# Altium schematic sheet boxer_main.SchDoc: Schemat blokowy
size A4; DrawnBy: Damian Dolewski; Engineer: Damian Dolewski; DocumentNumber: 1; SheetNumber: 1; SheetTotal: 7
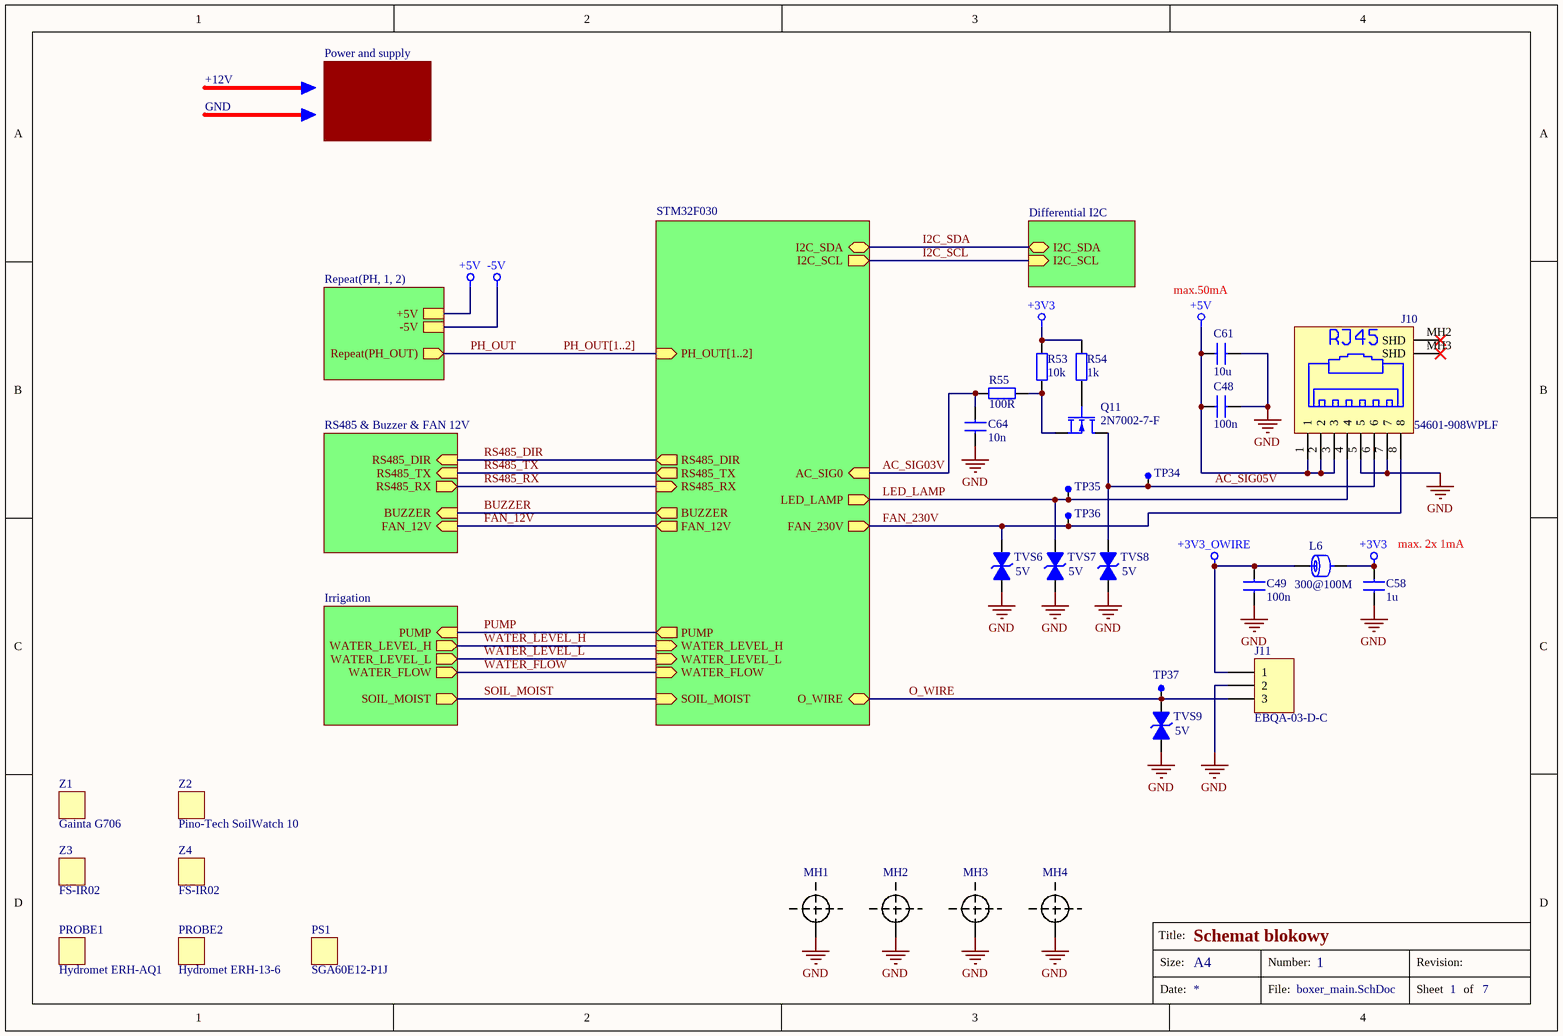
[diagram p0: boxer_main.SchDoc]

## Parts
C48  value 100n  [C_0805]  (hidden comment: Capacitor)
C49  value 100n  [C_0805]  (hidden comment: Capacitor)
C58  value 1u  [C_0805]  (hidden comment: C0805C105K4RACAUTO)
C61  value 10u  [C_1206]  (hidden comment: Capacitor)
C64  value 10n  [C_0805]  (hidden comment: Capacitor)
J10  54601-908WPLF  [RJ45_54601-908WPLF]
J11  EBQA-03-D-C  [284512-3]
L6  value 300@100M  [L_0805]  (hidden comment: 742792031)
MH1  Mounting hole  [MH_M2.5]  (value not drawn)
MH2  Mounting hole  [MH_M2.5]  (value not drawn)
MH3  Mounting hole  [MH_M2.5]  (value not drawn)
MH4  Mounting hole  [MH_M2.5]  (value not drawn)
PROBE1  Hydromet ERH-AQ1  (mechanical)
PROBE2  Hydromet ERH-13-6  (mechanical)
PS1  SGA60E12-P1J  (mechanical)
Q11  2N7002-7-F  [SOT-23]
R53  value 10k  [R_1206]  (hidden comment: Resistor)
R54  value 1k  [R_0805]  (hidden comment: Resistor)
R55  value 100R  [R_0805]  (hidden comment: Resistor)
TP34  TEST PAD  [PIN]  (value not drawn)
TP35  TEST PAD  [PIN]  (value not drawn)
TP36  TEST PAD  [PIN]  (value not drawn)
TP37  TEST PAD  [PIN]  (value not drawn)
TVS6  value 5V  [D_SMA]  (hidden comment: SMAJ5.0ALFCT-ND)
TVS7  value 5V  [D_SMA]  (hidden comment: SMAJ5.0ALFCT-ND)
TVS8  value 5V  [D_SMA]  (hidden comment: SMAJ5.0ALFCT-ND)
TVS9  value 5V  [D_SMA]  (hidden comment: SMAJ5.0ALFCT-ND)
Z1  Gainta G706  [Gainta G706]
Z2  Pino-Tech SoilWatch 10  (mechanical)
Z3  FS-IR02  (mechanical)
Z4  FS-IR02  (mechanical)

## Sub-sheets
Differential I2C = boxer_I2C_diff.SchDoc: I2C_SDA (bidir), I2C_SCL (in)
Irrigation = boxer_irrigation.SchDoc: SOIL_MOIST (out), PUMP (in), WATER_FLOW (out), WATER_LEVEL_H (out), WATER_LEVEL_L (out)
Power and supply = boxer_supply.SchDoc: no entries
Repeat(PH, 1, 2) = boxer_pH.SchDoc: Repeat(PH_OUT) (out), +5V, -5V
RS485 & Buzzer & FAN 12V = boxer_analog.SchDoc: BUZZER (in), FAN_12V (in), RS485_TX (in), RS485_RX (out), RS485_DIR (in)
STM32F030 = boxer_stm32.SchDoc: WATER_FLOW (in), SOIL_MOIST (in), BUZZER (out), PUMP (out), FAN_12V (out), O_WIRE (bidir), FAN_230V (out), AC_SIG0 (in), I2C_SDA (bidir), LED_LAMP (out), I2C_SCL (out), RS485_DIR (out), RS485_TX (out), RS485_RX (in), PH_OUT[1..2] (in), WATER_LEVEL_H (in), WATER_LEVEL_L (in)

## Nets
+3V3: C58.2 L6.2 R53.2 R54.2
+3V3_OWIRE: C49.1 J11.1 L6.1
+5V: C48.2 C61.2 J10.1 J10.2 J10.3 ; sheet Repeat(PH, 1, 2)/+5V
-5V: sheet Repeat(PH, 1, 2)/-5V
GND: C48.1 C49.2 C58.1 C61.1 C64.2 J10.5 J10.7 J11.2 MH1.MH MH2.MH MH3.MH MH4.MH TVS6.1(A) TVS7.1(A) TVS8.1(A) TVS9.1(A)
AC_SIG03V: C64.1 R55.2 ; sheet STM32F030/AC_SIG0
AC_SIG05V: J10.6 Q11.3(D) TP34.1 TVS8.2(K)
BUZZER: sheet STM32F030/BUZZER, sheet RS485 & Buzzer & FAN 12V/BUZZER
FAN_12V: sheet STM32F030/FAN_12V, sheet RS485 & Buzzer & FAN 12V/FAN_12V
FAN_230V: J10.8 TP36.1 TVS6.2(K) ; sheet STM32F030/FAN_230V
I2C_SCL: sheet STM32F030/I2C_SCL, sheet Differential I2C/I2C_SCL
I2C_SDA: sheet STM32F030/I2C_SDA, sheet Differential I2C/I2C_SDA
LED_LAMP: J10.4 TP35.1 TVS7.2(K) ; sheet STM32F030/LED_LAMP
O_WIRE: J11.3 TP37.1 TVS9.2(K) ; sheet STM32F030/O_WIRE
PH_OUT: sheet Repeat(PH, 1, 2)/Repeat(PH_OUT)
PUMP: sheet Irrigation/PUMP, sheet STM32F030/PUMP
RS485_DIR: sheet STM32F030/RS485_DIR, sheet RS485 & Buzzer & FAN 12V/RS485_DIR
RS485_RX: sheet STM32F030/RS485_RX, sheet RS485 & Buzzer & FAN 12V/RS485_RX
RS485_TX: sheet STM32F030/RS485_TX, sheet RS485 & Buzzer & FAN 12V/RS485_TX
SOIL_MOIST: sheet Irrigation/SOIL_MOIST, sheet STM32F030/SOIL_MOIST
WATER_FLOW: sheet Irrigation/WATER_FLOW, sheet STM32F030/WATER_FLOW
WATER_LEVEL_H: sheet Irrigation/WATER_LEVEL_H, sheet STM32F030/WATER_LEVEL_H
WATER_LEVEL_L: sheet Irrigation/WATER_LEVEL_L, sheet STM32F030/WATER_LEVEL_L
NetQ11_1: Q11.1(G) R54.1
NetQ11_2: Q11.2(S) R53.1 R55.1

Not connected (* = marked no-connect by the designer): J10 MH2(SHD)* MH3(SHD)*

## Buses and harness runs
bus PH_OUT[1..2] = sheet STM32F030/PH_OUT[1..2]

## Notes on the sheet
- +12V
- GND
- max.50mA
- (near C58) max. 2x 1mA
- Title:
- Size:
- A4
- Number:
- Revision:
- Date:
- File:
- Sheet
- of

## Library data of the parts
C58 = Capacitor
J10 = RJ45-8: RJ45 Socket, 8pin, No Key, Molex MX-95001-2881; Value: 54601-908WPLF
J11 = Header 3: Header, 3-Pin; Value: EBQA-03-D-C
L6 = FB: Ferrite Bead
MH1-MH4 = Mounting hole: Mounting hole 2.3mm
PROBE1 = ERH-AQ1: Hydromet ERH-AQ1 Water pH probe
PROBE2 = ERH-13-6: Hydromet ERH-AQ1 Soil pH probe
PS1 = EPS-45-12
Q11 = MOSFET-N: N-Channel MOSFET; Value: 2N7002-7-F
TP34-TP37 = TEST_PAD
TVS6-TVS9 = Transil
Z1 = ENCLOSURE
Z2 = SoilWatch10: Capacitance Water Soil Sensor, 75MHz; Vcc - 3,1- 5VDC; Vout - analog 0-3VDC; Ioutmax = 24mA; Temp. = 2*C - 45*C; IP67
Z3 Z4 = FS-IR02: IR Liquid Level Sensor, Vcc 5VDC; Iout = 12mA; Temp. = -25*C - 105*C